# Altium project CAN-Shield.PrjPCB
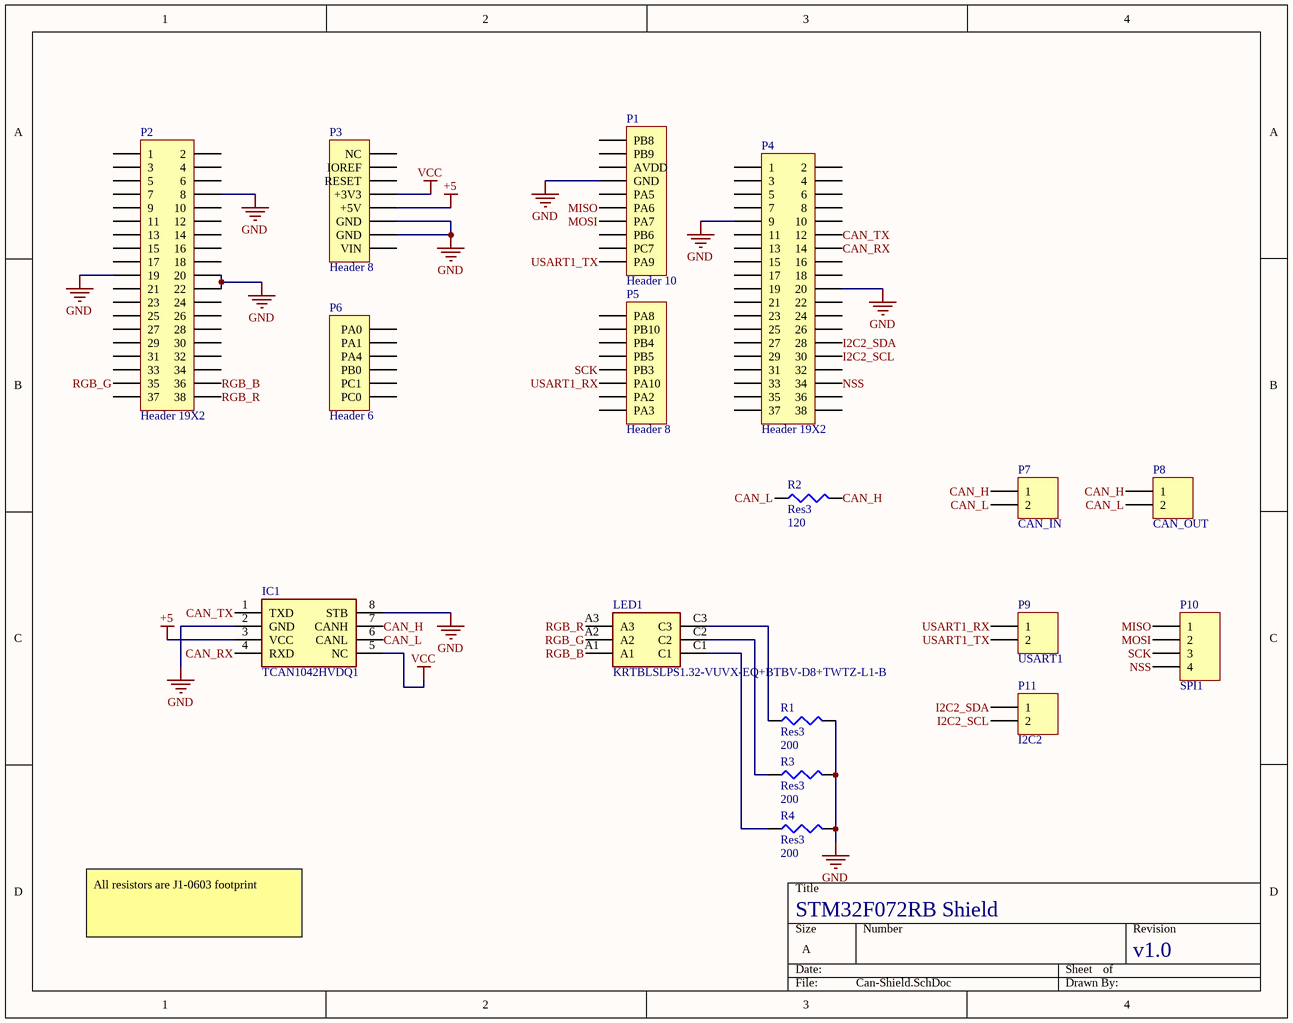
[diagram p0: Can-Shield.SchDoc]
1 sheet, 17 parts. Net scope: global (net labels, ports and power ports of the same name join across sheets).
Board file: CAN-Shield.PcbDoc

## Sheet Can-Shield.SchDoc
size A

### Parts
IC1  TCAN1042HVDQ1  [SOIC127P600X175-8N]
LED1  KRTBLSLPS1.32-VUVX-EQ+BTBV-D8+TWTZ-L1-B  [KRTBLSLPS132VUVXEQBTBVD8TWTZL1B]
P1  Header 10  [HDR1X10]
P2  Header 19X2  [HDR2X19]
P3  Header 8  [HDR1X8]
P4  Header 19X2  [HDR2X19]
P5  Header 8  [HDR1X8]
P6  Header 6  [HDR1X6]
P7  CAN_IN  [HDR1X2]
P8  CAN_OUT  [HDR1X2]
P9  USART1  [HDR1X2]
P10  SPI1  [HDR1X4]
P11  I2C2  [HDR1X2]
R1  Res3  value 200  [J1-0603]
R2  Res3  value 120  [J1-0603]
R3  Res3  value 200  [J1-0603]
R4  Res3  value 200  [J1-0603]

### Nets
+5: IC1.3(VCC) P3.5(+5V)
GND: IC1.2(GND) IC1.8(STB) P1.4(GND) P2.8 P2.19 P2.20 P2.22 P3.6(GND) P3.7(GND) P4.9 P4.20 R1.2 R3.2 R4.2
VCC: IC1.5(NC) P3.4(+3V3)
CAN_H: IC1.7(CANH) P7.1 P8.1 R2.2
CAN_L: IC1.6(CANL) P7.2 P8.2 R2.1
CAN_RX: IC1.4(RXD) P4.14
CAN_TX: IC1.1(TXD) P4.12
I2C2_SCL: P4.30 P11.2
I2C2_SDA: P4.28 P11.1
MISO: P1.6(PA6) P10.1
MOSI: P1.7(PA7) P10.2
NSS: P4.34 P10.4
RGB_B: LED1.A1 P2.36
RGB_G: LED1.A2 P2.35
RGB_R: LED1.A3 P2.38
SCK: P5.5(PB3) P10.3
USART1_RX: P5.6(PA10) P9.1
USART1_TX: P1.10(PA9) P9.2
NetLED1_C1: LED1.C1 R4.1
NetLED1_C2: LED1.C2 R3.1
NetLED1_C3: LED1.C3 R1.1

Not connected (* = marked no-connect by the designer): P1 1(PB8) 2(PB9) 3(AVDD) 5(PA5) 8(PB6) 9(PC7); P2 1 2 3 4 5 6 7 9 10 11 12 13 14 15 16 17 18 21 23 24 25 26 27 28 29 30 31 32 33 34 37; P3 1(NC) 2(IOREF) 3(RESET) 8(VIN); P4 1 2 3 4 5 6 7 8 10 11 13 15 16 17 18 19 21 22 23 24 25 26 27 29 31 32 33 35 36 37 38; P5 1(PA8) 2(PB10) 3(PB4) 4(PB5) 7(PA2) 8(PA3); P6 1(PA0) 2(PA1) 3(PA4) 4(PB0) 5(PC1) 6(PC0)

### Notes on the sheet
- All resistors are J1-0603 footprint
- STM32F072RB Shield
- v1.0

### Library data of the parts
IC1 = TCAN1042HVDQ1: Integrated Circuit; Manufacturer_Name: Texas Instruments; Datasheet Link: http://www.ti.com/lit/gpn/tcan1042hv-q1; Height: 1.75mm; Manufacturer_Part_Number: TCAN1042HVDQ1; Arrow Part Number: TCAN1042HVDQ1; Arrow Price/Stock: https://www.arrow.com/en/products/tcan1042hvdq1/texas-instruments; Mouser Part Number: 595-TCAN1042HVDQ1; Mouser Price/Stock: https://www.mouser.com/Search/Refine.aspx?Keyword=595-TCAN1042HVDQ1
LED1 = KRTBLSLPS1.32-VUVX-EQ+BTBV-D8+TWTZ-L1-B: LED; Manufacturer_Name: OSRAM; Datasheet Link: https://dammedia.osram.info/media/resource/hires/osram-dam-6176296/KRTB%20LSLPS1.32_EN.pdf; Height: 2.04mm; Manufacturer_Part_Number: KRTBLSLPS1.32-VUVX-EQ+BTBV-D8+TWTZ-L1-B; Arrow Part Number: KRTBLSLPS1.32-VUVX-EQ+BTBV-D8+TWTZ-L1-B; Mouser Part Number: 720-KRTBLSLPS13A0062; Mouser Price/Stock: https://www.mouser.co.uk/ProductDetail/OSRAM-Opto-Semiconductors/KRTBLSLPS132-VUVX-EQ%2bBTBV-D8%2bTWTZ-L1-B?qs=OlC7AqGiEDms9aB20KQuCA%3D%3D
P1 = Header 10: Header, 10-Pin; LatestRevisionDate: 17-Jul-2002; LatestRevisionNote: Re-released for DXP Platform.; Publisher: Altium Limited
P2 P4 = Header 19X2: Header, 19-Pin, Dual row; LatestRevisionDate: 17-Jul-2002; LatestRevisionNote: Re-released for DXP Platform.; Publisher: Altium Limited
P3 P5 = Header 8: Header, 8-Pin; LatestRevisionDate: 17-Jul-2002; LatestRevisionNote: Re-released for DXP Platform.; Publisher: Altium Limited
P6 = Header 6: Header, 6-Pin; LatestRevisionDate: 17-Jul-2002; LatestRevisionNote: Re-released for DXP Platform.; Publisher: Altium Limited
P7-P9 P11 = Header 2: Header, 2-Pin; LatestRevisionDate: 17-Jul-2002; LatestRevisionNote: Re-released for DXP Platform.; Publisher: Altium Limited
P10 = Header 4: Header, 4-Pin; LatestRevisionDate: 17-Jul-2002; LatestRevisionNote: Re-released for DXP Platform.; Publisher: Altium Limited
R1-R4 = Res3: Resistor; Published: 8-Jun-2000; LatestRevisionDate: 29-May-2009; LatestRevisionNote: IPC-7351 Footprint Added.; PackageReference: J1-0603; Publisher: Altium Limited; PackageDescription: Chip Resistor